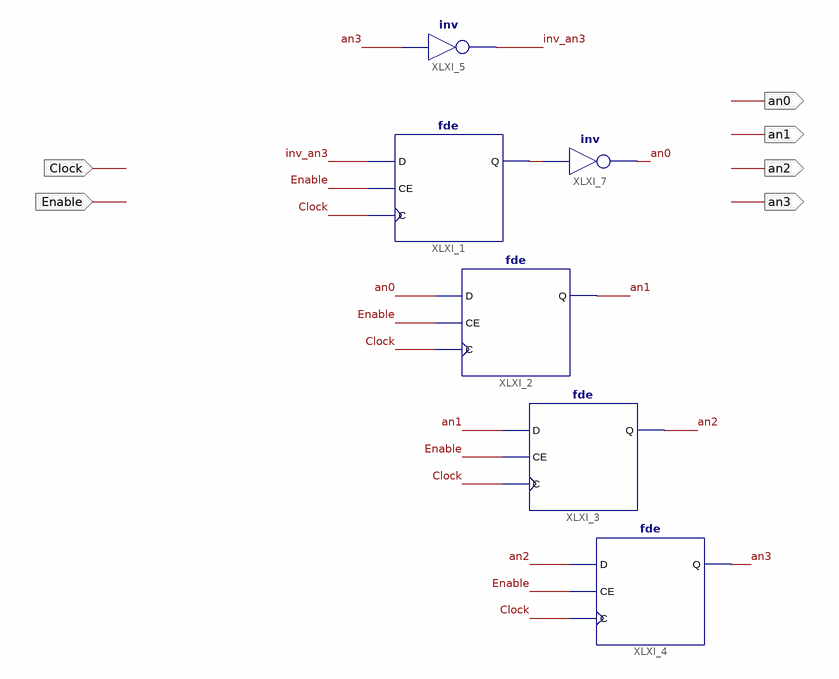
[diagram p0: schematic sheet 1]
// Xilinx ISE schematic Ring_Counter.sch (spartan3e) as structural Verilog: 6 symbols, 6 ports
module Ring_Counter (
  input  Clock,
  input  Enable,
  output an0,
  output an1,
  output an2,
  output an3
);

  wire inv_an3, XLXN_2;

  fde XLXI_1 (.C(Clock), .CE(Enable), .D(inv_an3), .Q(XLXN_2));
  fde XLXI_2 (.C(Clock), .CE(Enable), .D(an0), .Q(an1));
  fde XLXI_3 (.C(Clock), .CE(Enable), .D(an1), .Q(an2));
  fde XLXI_4 (.C(Clock), .CE(Enable), .D(an2), .Q(an3));
  not XLXI_5 (inv_an3, an3);
  not XLXI_7 (an0, XLXN_2);
endmodule
